# Altium schematic sheet mboard_dcdc.SchDoc: =GlobalProjectName
size 209 x 297 mm; SheetNumber: Лист; SheetTotal: Листов; PageSetup: Record=PageOptions|CenterHorizontal=True|CenterVertical=True|PrintScale=1.00|XCorrection=1.00|YCorrection=1.00|PrintKind=1|BorderSize=5000000|LeftOffset=0|BottomOffset=0|Orientation=2|PaperLength=1000|PaperWidth=1000|Scale=100|PaperSource=15|PrintQuality=1200|MediaType=1|DitherType=10|PaperKind=A3|PrintScaleMode=1; Weight: -; ScaleFactor: -
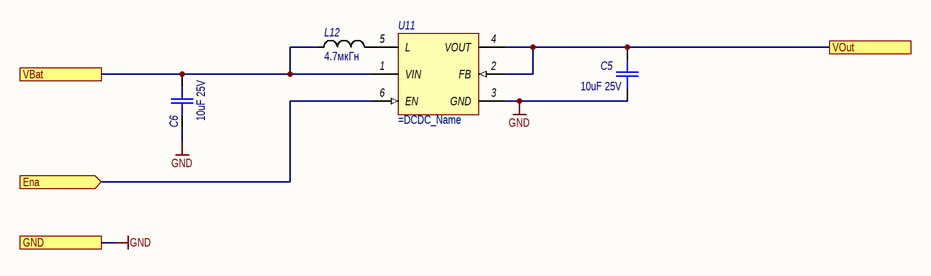
[diagram p0: mboard_dcdc.SchDoc]

## Parts
L12  value 4.7мкГн  [SMD_0805]  (hidden comment: Inductor)
U11  TPS61222  [SC-70_6]  (value not drawn)
С5  10uF 25V  [SMD_C0603]
С6  10uF 25V  [SMD_C0603]

## Ports
Ena (in), GND, VBat, VOut

## Nets
GND: U11.3(GND) С5.1 С6.1 ; port GND
Ena: U11.6(EN) ; port Ena
VBat: L12.1 U11.1(VIN) С6.2 ; port VBat
VOut: U11.2(FB) U11.4(VOUT) С5.2 ; port VOut
NetL12_2: L12.2 U11.5(L)

## Notes on the sheet
- Подп. и дата
- Инв. № дубл.
- Взам. инв. №
- Инв. № подл.
- Изм.
- Лист
- № докум.
- Подп.
- Дата
- Форма 2а ГОСТ 2.104-2006
- Копировал
- Формат А4

## Library data of the parts
L12 = Inductor: Наименование: Индуктивность; Назначение: SMD-индуктивность; Потребление, Вт: 0,010
U11 = TPS6122x: Boost Voltage Converter with 0.7 to 5.5 V Input and 5 V Output, -40 to 85 degC, 6-Pin SC70 (DCK), Green (RoHS & no Sb/Br); Потребление, Вт: 0.01; ComponentLink1URL: http://www.ti.com/general/docs/lit/getliterature.tsp?genericPartNumber=TPS61222&fileType=pdf; ComponentLink2Description: Package Specification; ComponentLink1Description: Datasheet; ComponentLink2URL: http://www.ti.com/litv/pdf/mpds114c; Назначение: Boost Voltage Converter with 0.7 to 5.5 V Input and 5 V Output; Наименование: =DCDC_Name
С5 С6 = Capacitor: SMD 0603; Наименование: Конденсатор; Потребление, Вт: 0; Точность: 20%; Напряжение: 25В; Назначение: SMD 0603; Value: 10uF 25V